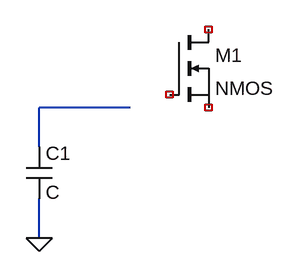
[diagram p0: schematic ana_memory_cell-0.1.asc]
ana_memory_cell-0.1.asc, the LTspice schematic file:
Version 4
SHEET 1 880 680
WIRE 288 48 176 48
WIRE 176 96 176 48
WIRE 176 208 176 160
FLAG 176 208 0
SYMBOL cap 160 96 R0
SYMATTR InstName C1
SYMBOL nmos 336 -48 R0
SYMATTR InstName M1

The netlist it stands for:
* ana_memory_cell-0.1.asc
C1 N001 0 C
M1 NC_01 NC_02 NC_03 NC_03 NMOS
.model NMOS NMOS
.model PMOS PMOS
.lib standard.mos
.backanno
.end